# Altium project DTCP v1.2.PrjPcb (part 2 of 2)

## Sheet Boost 12V.SchDoc
size A4; SheetNumber: 3; SheetTotal: 12
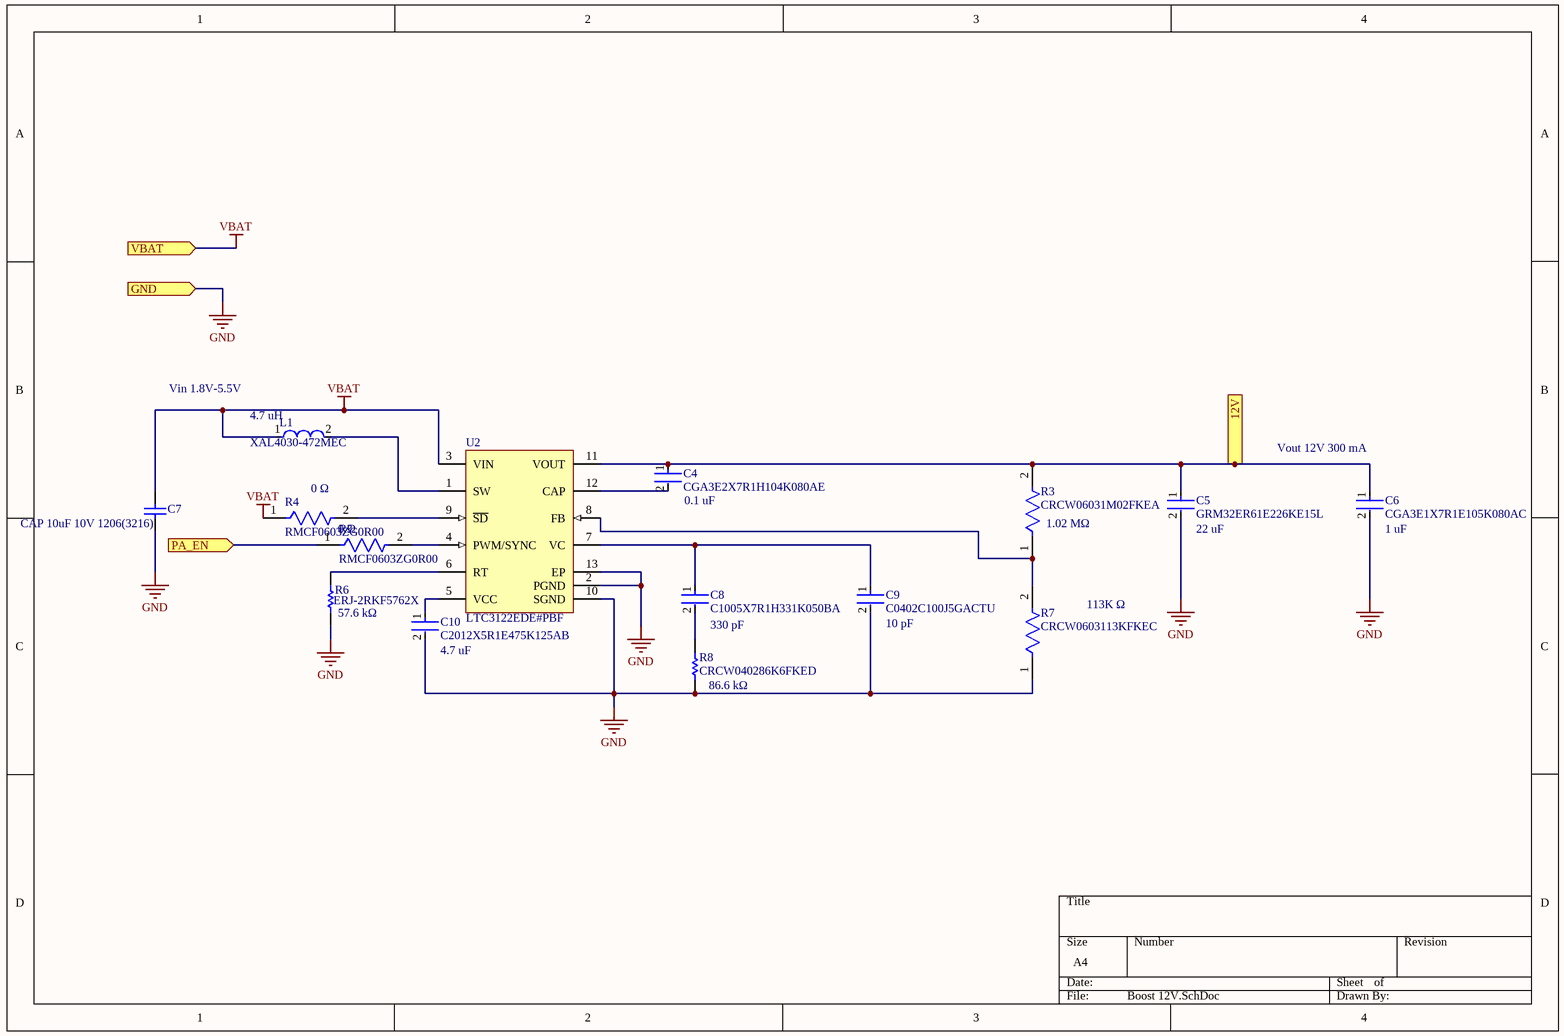
[diagram p7: Boost 12V.SchDoc]

### Parts
(Parts that share a designator on the sheet are numbered #1, #2 ... from top to bottom, then left to right.)
C4  CGA3E2X7R1H104K080AE  [FP-CGA3E-0_3-0_1-IPC_A]
C5  GRM32ER61E226KE15L  [FP-GRM32-MFG]
C6  CGA3E1X7R1E105K080AC  [FP-CGA3E-0_3-0_1-IPC_A]
C7  CAP 10uF 10V 1206(3216)  [CAPC1206(3216)190_L]
C8  C1005X7R1H331K050BA  [FP-C1005-050-0_05-IPC_B]
C9  C0402C100J5GACTU  [FP-C0402-BB-MFG]
C10  C2012X5R1E475K125AB  [FP-C2012-125-0_2-MFG]
L1  XAL4030-472MEC  [FP-XAL4030-472MEC-MFG]
R3  CRCW06031M02FKEA  [FP-CRCW0603-e3-IPC_A]
R4  RMCF0603ZG0R00  [FP-RMCF0603-IPC_B]
R6  ERJ-2RKF5762X  [RESC1005X40X25NL05T05]
R7  CRCW0603113KFKEC  [FP-CRCW0603-e3-MFG]
R8  CRCW040286K6FKED  [RESC1005X40X25NL05T05]
R?#2  RMCF0603ZG0R00  [FP-RMCF0603-IPC_B]
U2  LTC3122EDE#PBF  [LT-DE-UE-12_V]

### Ports
12V (out), GND (in), PA_EN (in), VBAT (in)

### Nets
12V0: C4.1 C5.1 C6.1 R3.2 U2.11(VOUT) ; port 12V
GND: C5.2 C6.2 C7.1 C9.2 C10.2 R6.1 R7.1 R8.1 U2.2(PGND) U2.10(SGND) U2.13(EP) ; port GND
VBAT: C7.2 L1.1 R4.1 U2.3(VIN) ; port VBAT
NetC4_2: C4.2 U2.12(CAP)
NetC8_1: C8.1 C9.1 U2.7(VC)
NetC8_2: C8.2 R8.2
NetC10_1: C10.1 U2.5(VCC)
NetL1_2: L1.2 U2.1(SW)
NetR3_1: R3.1 R7.2 U2.8(FB)
NetR4_2: R4.2 U2.9(~{SD})
NetR6_2: R6.2 U2.6(RT)
NetR?#2_1: R?#2.1 ; port PA_EN
NetR?#2_2: R?#2.2 U2.4(PWM/SYNC)

### Notes on the sheet
- Vin 1.8V-5.5V
- (near L1) 4.7 uH
- (near C6) Vout 12V 300 mA
- (near R4) 0 Ω
- (near C4) 0.1 uF
- 0 Ω
- (near R3) 1.02 MΩ
- (near C5) 22 uF
- (near C6) 1 uF
- (near R6) 57.6 kΩ
- (near C10) 4.7 uF
- 330 pF
- (near C9) 10 pF
- 113K Ω
- (near R8) 86.6 kΩ

### Library data of the parts
C4 = CMP-08246-002410-1: Cap Ceramic 100nF 50V X7R 10% Pad SMD 0603 +125°C Automotive T/R; Thickness: 0.035inch; Dielectric: X7R; Height: 0.8mm; Min Operating Temperature: -55°C; Package Quantity: 4000; Voltage Rating: 50V; Voltage Rating (DC): 50V; Lead Free: Lead Free; Case Code (Metric): 1608; Ratings: AEC-Q200; Capacitance: 100nF; Length: 0.063inch; Width: 0.8mm; Weight: 7.1E-05oz; Case/Package: 0603; Case Code (Imperial): 0603; Termination: SMD/SMT; Mount: Surface Mount; Packaging: Tape and Reel; Max Operating Temperature: 125°C; Tolerance: 10%; Features: Soft Termination
C5 = CMP-2000-05458-2: CAP CER 22UF 25V X5R 1210; Manufacturer: Murata Electronics North America; Possible Substitute: GRM32ER61E226KE15K; Other Names: 490-3889-2; Material: Ceramic; Tolerance: 10%; Digikey Description: CAP CER 22UF 25V X5R 1210; Mouser Description: Multilayer Ceramic Capacitors MLCC - SMD/SMT 1210 22uF 25volts X5R 10%; Device Class L2: Capacitors; Height: 2.7mm; Temperature Characteristic: X5R; Category: Cap; RoHS: TRUE; Operating Temperature: -55°C ~ 85°C; Temperature: -55°C to +85°C; Lead Free: Yes; Package: GRM32; Temperature Range High: +85°C; Package / Case: 1210 (3225 Metric); Standard Package: 1,000; Packaging: Cut Tape (CT); Capacitance: 22uF; Thickness (Max): 0.106" (2.70mm); Value: 22uF; Automotive: No; Device Class L1: Passive Components; Voltage - Rated: 25V; Temperature Range Low: -55°C; Size / Dimension: 0.126" L x 0.098" W (3.20mm x 2.50mm); ComponentLink2Description: Datasheet; Device Class L3: Ceramic Capacitors; Temperature Coefficient: X5R; ComponentLink2URL: https://search.murata.co.jp/Ceramy/image/img/A01X/G101/ENG/GRM32ER61E226KE15-01A.pdf; Voltage Rating: 25V; Manufacturer Part Number: GRM32ER61E226KE15L; Octopart: https://octopart.com/grm32er61e226ke15l-murata-197441; Applications: General Purpose; Mounting Type: Surface Mount, MLCC
C6 = CMP-08246-001507-1: Cap Ceramic 1uF 25V X7R 10% Pad SMD 0603 +125°C Automotive T/R; Dielectric: X7R; Capacitance: 1uF; Voltage Rating: 25V; Thickness: 0.035inch; Width: 0.031inch; Ratings: AEC-Q200; Case Code (Metric): 1608; REACH SVHC: No SVHC; Voltage: 25V; Composition: Ceramic; Min Operating Temperature: -55°C; Termination: SMD/SMT; Depth: 0.8mm; Max Operating Temperature: 125°C; Mount: Surface Mount; Weight: 7.1E-05oz; Package Quantity: 4000; Tolerance: 10%; Packaging: Tape and Reel; Lead Free: Lead Free; Case/Package: 0603; Length: 1.6mm; Height: 0.8mm; Case Code (Imperial): 0603; Voltage Rating (DC): 25V
C7 = CMP-1037-04967-1: CAP 10uF 10V ±10% 1206 (3216 Metric) Thickness 1.9mm SMD; Tolerance: Â±10%; Case-Metric: 3216; Case-EIA: 1206; Rated Voltage: 10 V; Max Thickness: 1.9 mm; Technology: SMT; Value: 10uF
C8 = CMP-08246-002681-1: Multilayer Ceramic Capacitors 330pF ±10% 50V X7R SMD 0402; Height: 0.5mm; Min Operating Temperature: -55°C; Construction: Flat; Voltage Rating (DC): 50V; Depth: 0.5mm; Number of Pins: 2; Capacitance: 330pF; Case/Package: 0402; REACH SVHC: No SVHC; Lead Free: Lead Free; Thickness: 0.022inch; Package Quantity: 1; Case Code (Imperial): 0402; Max Operating Temperature: 125°C; RoHS Compliant: Yes; Voltage Rating: 50V; Length: 1mm; Weight: 2.3E-05oz; Width: 0.02inch; Case Code (Metric): 1005; Dielectric Material: Ceramic; Tolerance: 10%; Mount: Surface Mount; Dielectric: X7R; Series: C; Resistor Type: Ceramic; Termination: SMD/SMT; Packaging: Tape and Reel
C9 = CMP-2008-03404-2: Multilayer Ceramic Capacitor, C Series, 10 Pf, - 5%, C0G / Np0, 50 V, 0402 [1005 Metric] Rohs Compliant: Yes; Manufacturer: Kemet; Temperature Coefficient: 15%; Voltage Rating: 50 V; Capacitance: 10 pF; Value: 10 pF; Tolerance: 0.05; Automotive: No; Temperature Range High: +125°C; ComponentLink2Description: Datasheet; Manufacturer Part Number: C0402C100J5GACTU; Material: Ceramic; Lead Free: Yes; ComponentLink2URL: https://content.kemet.com/datasheets/KEM_C1002_X7R_SMD.pdf; Device Class L3: Ceramic Capacitors; RoHS: TRUE; Package: C0402-BB; Temperature: -55°C to +125°C; Temperature Range Low: -55°C; Height: 0.55mm; Mouser Description: Multilayer Ceramic Capacitor, C Series, 10 Pf, - 5%, C0G / Np0, 50 V, 0402 [1005 Metric] Rohs Compliant: Yes; Octopart: https://octopart.com/c0402c100j5gactu-kemet-108448; Digikey Description: Multilayer Ceramic Capacitor, C Series, 10 Pf, - 5%, C0G / Np0, 50 V, 0402 [1005 Metric] Rohs Compliant: Yes; Temperature Characteristic: C0G; Category: Cap; Ipc Land Pattern Name: CAPC10050X50; Device Class L1: Passive Components; Device Class L2: Capacitors
C10 = CMP-08246-004908-1: Multilayer Ceramic Capacitors 4.7μF ±10% 25V X5R SMD 0805; Capacitance: 4.7uF; Lead Free: Lead Free; Thickness: 0.057inch; Packaging: Tape and Reel; Min Operating Temperature: -55°C; RoHS Compliant: Yes; Dielectric: X5R; Weight: 0.000194oz; REACH SVHC: No SVHC; Voltage Rating (DC): 25V; Mount: Surface Mount; Resistor Type: Ceramic; Termination: SMD/SMT; Number of Pins: 2; Case Code (Imperial): 0805; Dielectric Material: Ceramic; Voltage: 25V; Voltage Rating: 25V; Case Code (Metric): 2012; Case/Package: 0805; Max Operating Temperature: 85°C; Height: 1.25mm; Tolerance: 10%; Depth: 1.25mm; Package Quantity: 1; Length: 2mm; Radiation Hardening: No; Width: 1.25mm
L1 = CMP-11268-000082-1: Power Inductor (SMD), 4.7 µH, 5.1 A, Shielded, 4.5 A, XAL40xx Series, 4mm x 4mm x 3.1mm; Tolerance: 20%; DC Resistance (DCR): 44.1mR; Inductance: 4.7uH; Saturation Current: 4.5A; Max DC Current: 5.1A; Self Resonant Frequency: 36MHz; Test Frequency: 100kHz; Core Material: Composite; REACH SVHC: No SVHC; Height: 3.1mm; Package Quantity: 500; Width: 4.3mm; Mount: Surface Mount; RoHS Compliant: Yes; Case/Package: SMD/SMT; Length: 4.3mm; Packaging: Tape and Reel; Max Operating Temperature: 125°C; Min Operating Temperature: -40°C; Series: XAL4030; Termination: SMD/SMT; Inductance Tolerance: 20%; Shielding: Shielded; RMS Current (Irms): 5.1A; Lead Free: Contains Lead
R3 = CMP-2000-03018-2: RES Thick Film, 1.02MΩ, 1%, 0.1W, 100ppm/°C, 0603; Voltage Rating (DC): 75V; Power Rating: 100mW; Resistance: 1.02MR; Features: Automotive AEC-Q200; Depth: 0.85mm; Max Operating Temperature: 155°C; Tolerance: 1%; Package Quantity: 10; Length: 1.55mm; Mount: Surface Mount; Termination: SMD/SMT; Width: 0.033inch; Temperature Coefficient: 100ppm/°C; Min Operating Temperature: -55°C; Composition: Thick Film; Max Power Dissipation: 100mW; Case Code (Imperial): 0603; Case/Package: 0603; Voltage Rating: 75V; Contact Plating: Tin; Case Code (Metric): 1608; Weight: 7.1E-05oz; Lead Free: Lead Free; Height: 0.02inch; Military Standard: Not; Number of Terminations: 2; Radiation Hardening: No; Packaging: Tape and Reel
R4 R?#2 = CMP-26527-006412-1: 0Ω ±0 0.1W 0603 Thick Film Chip Resistor AEC-Q200 compliant; Max Power Dissipation: 100mW; Resistance: 0R; Width: 0.031inch; RoHS Compliant: Yes; Number of Terminations: 2; Case/Package: 0603; Contact Plating: Tin; Height: 0.022inch; Resistor Type: Thick Film; Mount: Surface Mount; Length: 0.061inch; Features: Automotive AEC-Q200; Series: RMCF; Max Operating Temperature: 155°C; Radiation Hardening: No; Min Operating Temperature: -55°C; Packaging: Tape and Reel
R6 = CMP-2002-01001-1: Manufacturer: Panasonic; Part Number: ERJ-2RKF5762X
R7 = CMP-02407-003381-1: RES Thick Film, 113kΩ, 1%, 0.1W, 100ppm/°C, 0603; Power Rating: 100mW; Resistance: 113kR; Packaging: Tape and Reel; Width: 0.033inch; Lead Free: Lead Free; Case/Package: 0603; Height: 0.02inch; Length: 0.061inch; Max Power Dissipation: 100mW; Composition: Thick Film; Tolerance: 1%; Number of Terminations: 2; Max Operating Temperature: 155°C; Min Operating Temperature: -55°C; Temperature Coefficient: 100ppm/°C; Features: Automotive AEC-Q200; Package Quantity: 20000
R8 = CMP-2002-00247-1: Manufacturer: Vishay Dale; Part Number: CRCW040286K6FKED
U2 = CMP-0492-00369-1: 2.5 A Synchronous Step-Up DC/DC Converter with Output Disconnect, 12-pin SON (DE-UE-12), -40 to 125 degC, Pb-Free; Manufacturer: Linear Technology; Number of Outputs: 1; ComponentLink2URL: http://cds.linear.com/docs/en/datasheet/3122fa.pdf; ComponentLink1URL: http://www.linear.com/; Code_JEDEC: MO-229; ComponentLink2Description: Datasheet; ComponentLink1Description: Manufacturer URL; PackageReference: DE-UE-12; PackageVersion: Rev. D, 06/2010; ComponentLink3Description: Package Specification; PackageDescription: 12-Pin Plastic DFN, Body 4 x 3 mm, Pitch 0.5 mm; PartNumber: LTC3122EDE#PBF; ComponentLink3URL: http://cds.linear.com/docs/en/packaging/DFN_12_05-08-1695.pdf; Mounting Technology: Surface Mount; RoHS: TRUE; DatasheetVersion: Rev. A

## Sheet Switch1.SchDoc
size A; SheetNumber: 4; SheetTotal: 12
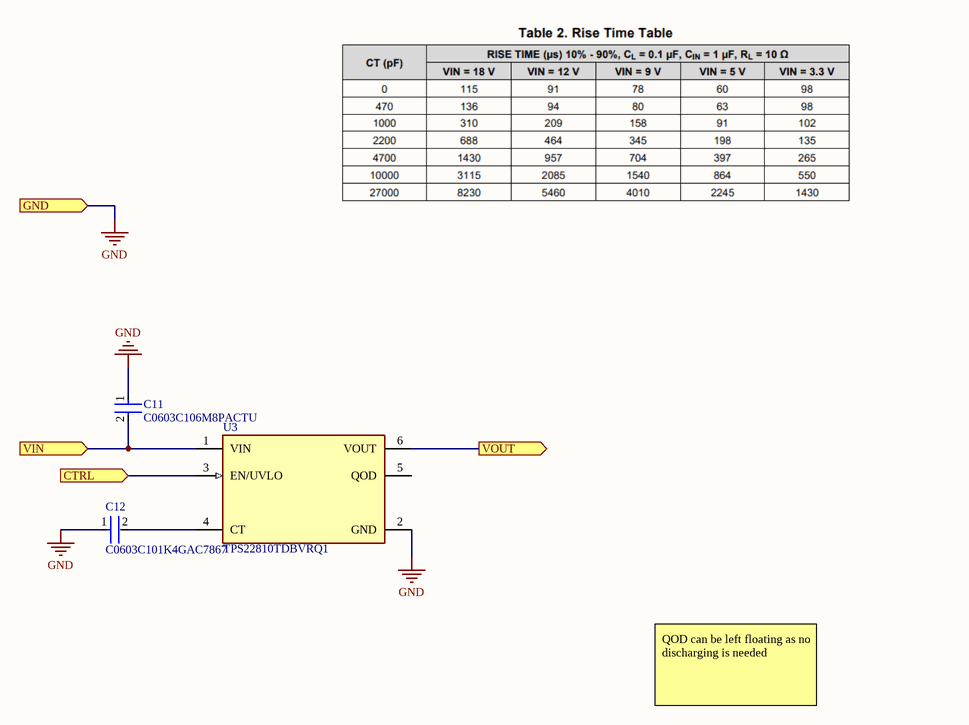
[diagram p8: Switch1.SchDoc]

### Parts
C11  C0603C106M8PACTU  [FP-C0603C106M8PACTU-MFG]
C12  C0603C101K4GAC7867  [FP-C0603C-CF-MFG]
U3  TPS22810TDBVRQ1  [FP-DBV0006A-MFG]

### Ports
CTRL (in), GND (in), VIN (in), VOUT (out)

### Nets
3V3: C11.2 U3.1(VIN) ; port VIN
3V3DDS: U3.6(VOUT) ; port VOUT
GND: C11.1 C12.1 U3.2(GND) ; port GND
NetC12_2: C12.2 U3.4(CT)
NetR1_2: U3.3(EN/UVLO) ; port CTRL

Not connected (* = marked no-connect by the designer): U3 5(QOD)

### Notes on the sheet
- QOD can be left floating as no discharging is needed

### Library data of the parts
C11 = CMP-03020-034654-1: CAP CER 10UF 10V X5R 0603; RoHS Compliant: Yes
C12 = CMP-03020-014723-2: CAP CER 100PF 16V NP0 0603; Manufacturer: KEMET; Automotive Grade: Grade 1; Material: Ceramic; Temperature Characteristic: C0G; Temperature Coefficient: 30ppm/°C; Tolerance: 0.1; Category: Cap; Temperature Range High: +125°C; RoHS: TRUE; Device Class L2: Capacitors; Automotive: Yes; Height: 0.87mm; Value: 100 pF; ComponentLink2Description: Datasheet; Digikey Description: CAP CER 100PF 16V NP0 0603; Manufacturer Part Number: C0603C101K4GAC7867; ComponentLink2URL: https://api.kemet.com/component-edge/download/datasheet/C0603C100J5GACAUTO.pdf; Device Class L1: Passive Components; Device Class L3: Ceramic Capacitors; Temperature: -55°C to +125°C; Lead Free: Yes; Capacitance: 100 pF; Temperature Range Low: -55°C; Voltage Rating: 16 V; Package: C0603C-CF; Octopart: https://octopart.com/c0603c101k4gac7867-kemet-1494535
U3 = CMP-04910-000007-2: IC PWR SWITCH N-CHAN 1:1 SOT23-6; Max Output Current: 2A; Max Supply Voltage: 18V; Min Supply Voltage: 2.7V; Number of Outputs: 1; Output Configuration: High Side; Fault Protection: Over Temperature; Interface: On/Off; Weight: 0.000801oz; Case/Package: SOT-23-6; Series: TPS22810-Q1; Package Quantity: 3000; RoHS Compliant: Yes; Number of Channels: 1; Max Operating Temperature: 105°C; Packaging: Cut Tape; Min Operating Temperature: -40°C

## Sheet Switch2.SchDoc
size A; SheetNumber: 11; SheetTotal: 12
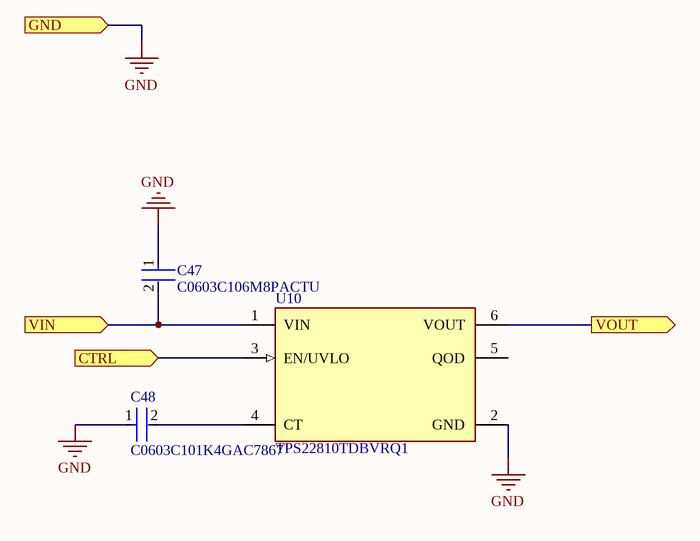
[diagram p9: Switch2.SchDoc]

### Parts
C47  C0603C106M8PACTU  [FP-C0603C106M8PACTU-MFG]
C48  C0603C101K4GAC7867  [FP-C0603C-CF-MFG]
U10  TPS22810TDBVRQ1  [FP-DBV0006A-MFG]

### Ports
CTRL (in), GND (in), VIN (in), VOUT (out)

### Nets
GND: C47.1 C48.1 U10.2(GND) ; port GND
PA2_VDD: U10.6(VOUT) ; port VOUT
NetC47_2: C47.2 U10.1(VIN) ; port VIN
NetC48_2: C48.2 U10.4(CT)
NetR?#2_1: U10.3(EN/UVLO) ; port CTRL

Not connected (* = marked no-connect by the designer): U10 5(QOD)

### Library data of the parts
C47 = CMP-03020-034654-1: CAP CER 10UF 10V X5R 0603; RoHS Compliant: Yes
C48 = CMP-03020-014723-2: as C12 on sheet Switch1; Category: Cap; Temperature Range High: +125°C; RoHS: TRUE; Device Class L2: Capacitors; Automotive: Yes; Height: 0.87mm; Value: 100 pF; ComponentLink2Description: Datasheet; Digikey Description: CAP CER 100PF 16V NP0 0603; Manufacturer Part Number: C0603C101K4GAC7867; ComponentLink2URL: https://api.kemet.com/component-edge/download/datasheet/C0603C100J5GACAUTO.pdf; Device Class L1: Passive Components; Device Class L3: Ceramic Capacitors; Temperature: -55°C to +125°C; Lead Free: Yes; Capacitance: 100 pF; Temperature Range Low: -55°C; Voltage Rating: 16 V; Package: C0603C-CF; Octopart: https://octopart.com/c0603c101k4gac7867-kemet-1494535
U10 = CMP-04910-000007-2: as U3 on sheet Switch1; Weight: 0.000801oz; Case/Package: SOT-23-6; Series: TPS22810-Q1; Package Quantity: 3000; RoHS Compliant: Yes; Number of Channels: 1; Max Operating Temperature: 105°C; Packaging: Cut Tape; Min Operating Temperature: -40°C

## Sheet Boost 5V.SchDoc
size A; SheetNumber: 12; SheetTotal: 12
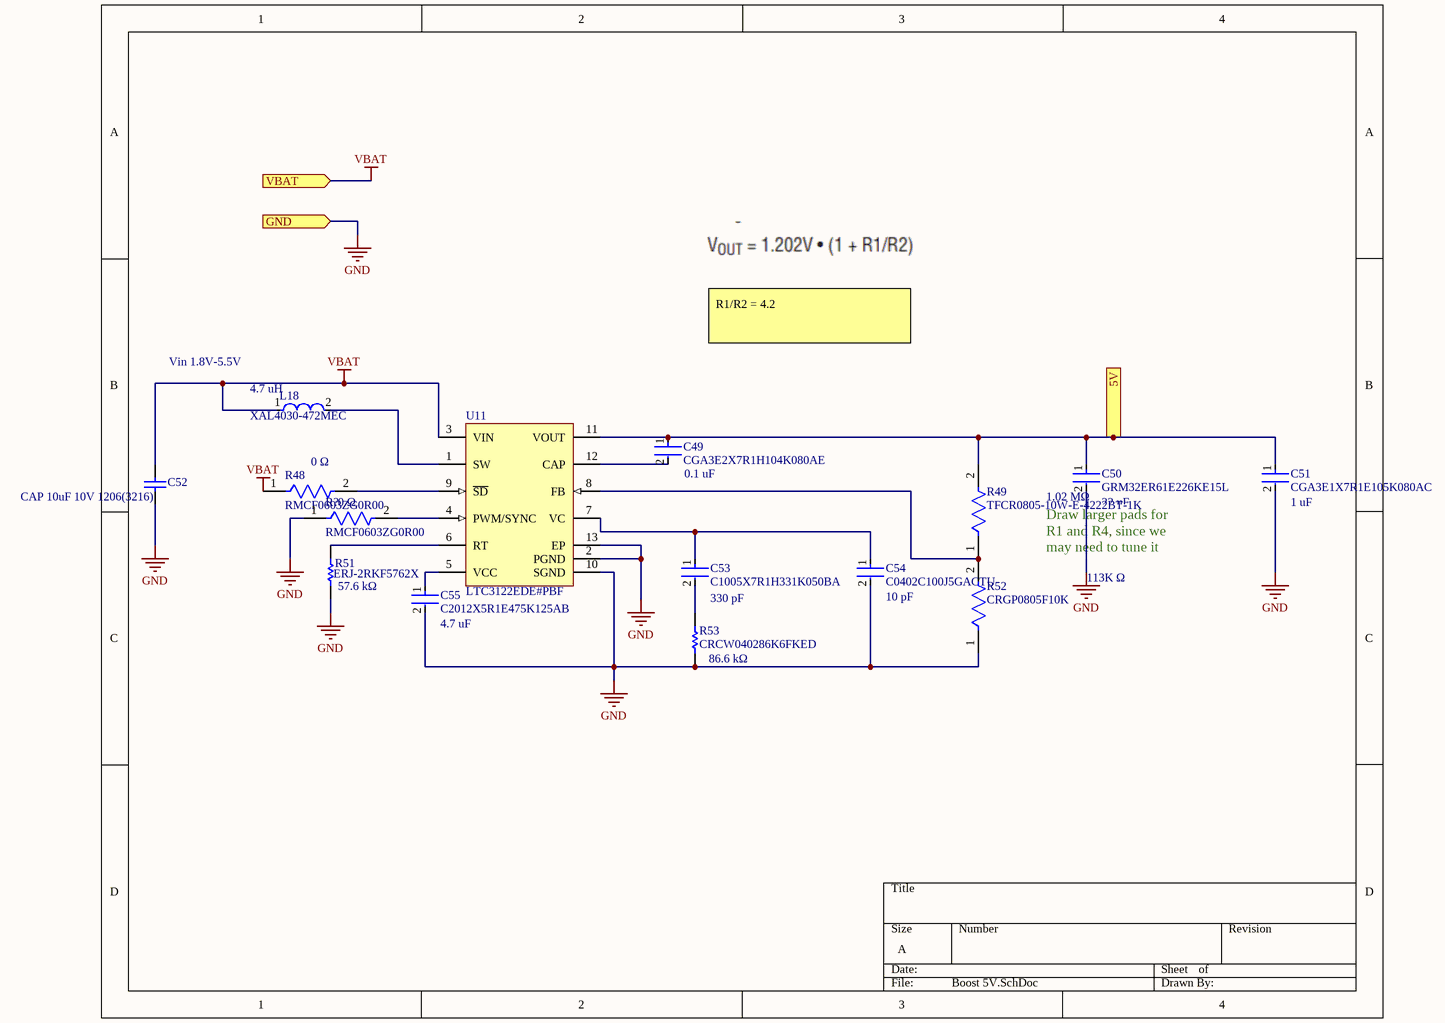
[diagram p10: Boost 5V.SchDoc]

### Parts
(Parts that share a designator on the sheet are numbered #1, #2 ... from top to bottom, then left to right.)
C49  CGA3E2X7R1H104K080AE  [FP-CGA3E-0_3-0_1-IPC_A]
C50  GRM32ER61E226KE15L  [FP-GRM32-MFG]
C51  CGA3E1X7R1E105K080AC  [FP-CGA3E-0_3-0_1-IPC_A]
C52  CAP 10uF 10V 1206(3216)  [CAPC1206(3216)190_L]
C53  C1005X7R1H331K050BA  [FP-C1005-050-0_05-IPC_B]
C54  C0402C100J5GACTU  [FP-C0402-BB-MFG]
C55  C2012X5R1E475K125AB  [FP-C2012-125-0_2-MFG]
L18  XAL4030-472MEC  [FP-XAL4030-472MEC-MFG]
R48  RMCF0603ZG0R00  [FP-RMCF0603-IPC_B]
R49  TFCR0805-10W-E-4222BT-1K  [FP-TFCR0805-IPC_A]
R51  ERJ-2RKF5762X  [RESC1005X40X25NL05T05]
R52  CRGP0805F10K  [FP-CRGP0805-IPC_C]
R53  CRCW040286K6FKED  [RESC1005X40X25NL05T05]
R?#3  RMCF0603ZG0R00  [FP-RMCF0603-IPC_B]
U11  LTC3122EDE#PBF  [LT-DE-UE-12_V]

### Ports
5V (out), GND (in), VBAT (in)

### Nets
5V0: C49.1 C50.1 C51.1 R49.2 U11.11(VOUT) ; port 5V
GND: C50.2 C51.2 C52.1 C54.2 C55.2 R51.1 R52.1 R53.1 R?#3.1 U11.2(PGND) U11.10(SGND) U11.13(EP) ; port GND
VBAT: C52.2 L18.1 R48.1 U11.3(VIN) ; port VBAT
NetC49_2: C49.2 U11.12(CAP)
NetC53_1: C53.1 C54.1 U11.7(VC)
NetC53_2: C53.2 R53.2
NetC55_1: C55.1 U11.5(VCC)
NetL18_2: L18.2 U11.1(SW)
NetR48_2: R48.2 U11.9(~{SD})
NetR49_1: R49.1 R52.2 U11.8(FB)
NetR51_2: R51.2 U11.6(RT)
NetR?#3_2: R?#3.2 U11.4(PWM/SYNC)

### Notes on the sheet
- Vin 1.8V-5.5V
- R1/R2 = 4.2
- (near L18) 4.7 uH
- (near R48) 0 Ω
- 0 Ω
- (near C49) 0.1 uF
- (near C50) 1.02 MΩ
- (near C50) 22 uF
- (near C51) 1 uF
- (near C50) Draw larger pads for R1 and R4, since we may need to tune it
- (near R51) 57.6 kΩ
- (near C55) 4.7 uF
- 330 pF
- (near C54) 10 pF
- 113K Ω
- (near R53) 86.6 kΩ

### Library data of the parts
C49 = CMP-08246-002410-1: as C4 on sheet Boost 12V; Thickness: 0.035inch; Dielectric: X7R; Height: 0.8mm; Min Operating Temperature: -55°C; Package Quantity: 4000; Voltage Rating: 50V; Voltage Rating (DC): 50V; Lead Free: Lead Free; Case Code (Metric): 1608; Ratings: AEC-Q200; Capacitance: 100nF; Length: 0.063inch; Width: 0.8mm; Weight: 7.1E-05oz; Case/Package: 0603; Case Code (Imperial): 0603; Termination: SMD/SMT; Mount: Surface Mount; Packaging: Tape and Reel; Max Operating Temperature: 125°C; Tolerance: 10%; Features: Soft Termination
C50 = CMP-2000-05458-2: as C5 on sheet Boost 12V; Digikey Description: CAP CER 22UF 25V X5R 1210; Mouser Description: Multilayer Ceramic Capacitors MLCC - SMD/SMT 1210 22uF 25volts X5R 10%; Device Class L2: Capacitors; Height: 2.7mm; Temperature Characteristic: X5R; Category: Cap; RoHS: TRUE; Operating Temperature: -55°C ~ 85°C; Temperature: -55°C to +85°C; Lead Free: Yes; Package: GRM32; Temperature Range High: +85°C; Package / Case: 1210 (3225 Metric); Standard Package: 1,000; Packaging: Cut Tape (CT); Capacitance: 22uF; Thickness (Max): 0.106" (2.70mm); Value: 22uF; Automotive: No; Device Class L1: Passive Components; Voltage - Rated: 25V; Temperature Range Low: -55°C; Size / Dimension: 0.126" L x 0.098" W (3.20mm x 2.50mm); ComponentLink2Description: Datasheet; Device Class L3: Ceramic Capacitors; Temperature Coefficient: X5R; ComponentLink2URL: https://search.murata.co.jp/Ceramy/image/img/A01X/G101/ENG/GRM32ER61E226KE15-01A.pdf; Voltage Rating: 25V; Manufacturer Part Number: GRM32ER61E226KE15L; Octopart: https://octopart.com/grm32er61e226ke15l-murata-197441; Applications: General Purpose; Mounting Type: Surface Mount, MLCC
C51 = CMP-08246-001507-1: as C6 on sheet Boost 12V; Dielectric: X7R; Capacitance: 1uF; Voltage Rating: 25V; Thickness: 0.035inch; Width: 0.031inch; Ratings: AEC-Q200; Case Code (Metric): 1608; REACH SVHC: No SVHC; Voltage: 25V; Composition: Ceramic; Min Operating Temperature: -55°C; Termination: SMD/SMT; Depth: 0.8mm; Max Operating Temperature: 125°C; Mount: Surface Mount; Weight: 7.1E-05oz; Package Quantity: 4000; Tolerance: 10%; Packaging: Tape and Reel; Lead Free: Lead Free; Case/Package: 0603; Length: 1.6mm; Height: 0.8mm; Case Code (Imperial): 0603; Voltage Rating (DC): 25V
C52 = CMP-1037-04967-1: as C7 on sheet Boost 12V; Rated Voltage: 10 V; Max Thickness: 1.9 mm; Technology: SMT; Value: 10uF
C53 = CMP-08246-002681-1: as C8 on sheet Boost 12V; Height: 0.5mm; Min Operating Temperature: -55°C; Construction: Flat; Voltage Rating (DC): 50V; Depth: 0.5mm; Number of Pins: 2; Capacitance: 330pF; Case/Package: 0402; REACH SVHC: No SVHC; Lead Free: Lead Free; Thickness: 0.022inch; Package Quantity: 1; Case Code (Imperial): 0402; Max Operating Temperature: 125°C; RoHS Compliant: Yes; Voltage Rating: 50V; Length: 1mm; Weight: 2.3E-05oz; Width: 0.02inch; Case Code (Metric): 1005; Dielectric Material: Ceramic; Tolerance: 10%; Mount: Surface Mount; Dielectric: X7R; Series: C; Resistor Type: Ceramic; Termination: SMD/SMT; Packaging: Tape and Reel
C54 = CMP-2008-03404-2: as C9 on sheet Boost 12V; Automotive: No; Temperature Range High: +125°C; ComponentLink2Description: Datasheet; Manufacturer Part Number: C0402C100J5GACTU; Material: Ceramic; Lead Free: Yes; ComponentLink2URL: https://content.kemet.com/datasheets/KEM_C1002_X7R_SMD.pdf; Device Class L3: Ceramic Capacitors; RoHS: TRUE; Package: C0402-BB; Temperature: -55°C to +125°C; Temperature Range Low: -55°C; Height: 0.55mm; Mouser Description: Multilayer Ceramic Capacitor, C Series, 10 Pf, - 5%, C0G / Np0, 50 V, 0402 [1005 Metric] Rohs Compliant: Yes; Octopart: https://octopart.com/c0402c100j5gactu-kemet-108448; Digikey Description: Multilayer Ceramic Capacitor, C Series, 10 Pf, - 5%, C0G / Np0, 50 V, 0402 [1005 Metric] Rohs Compliant: Yes; Temperature Characteristic: C0G; Category: Cap; Ipc Land Pattern Name: CAPC10050X50; Device Class L1: Passive Components; Device Class L2: Capacitors
C55 = CMP-08246-004908-1: as C10 on sheet Boost 12V; Lead Free: Lead Free; Thickness: 0.057inch; Packaging: Tape and Reel; Min Operating Temperature: -55°C; RoHS Compliant: Yes; Dielectric: X5R; Weight: 0.000194oz; REACH SVHC: No SVHC; Voltage Rating (DC): 25V; Mount: Surface Mount; Resistor Type: Ceramic; Termination: SMD/SMT; Number of Pins: 2; Case Code (Imperial): 0805; Dielectric Material: Ceramic; Voltage: 25V; Voltage Rating: 25V; Case Code (Metric): 2012; Case/Package: 0805; Max Operating Temperature: 85°C; Height: 1.25mm; Tolerance: 10%; Depth: 1.25mm; Package Quantity: 1; Length: 2mm; Radiation Hardening: No; Width: 1.25mm
L18 = CMP-11268-000082-1: as L1 on sheet Boost 12V; REACH SVHC: No SVHC; Height: 3.1mm; Package Quantity: 500; Width: 4.3mm; Mount: Surface Mount; RoHS Compliant: Yes; Case/Package: SMD/SMT; Length: 4.3mm; Packaging: Tape and Reel; Max Operating Temperature: 125°C; Min Operating Temperature: -40°C; Series: XAL4030; Termination: SMD/SMT; Inductance Tolerance: 20%; Shielding: Shielded; RMS Current (Irms): 5.1A; Lead Free: Contains Lead
R48 R?#3 = CMP-26527-006412-1: as R4 on sheet Boost 12V; Width: 0.031inch; RoHS Compliant: Yes; Number of Terminations: 2; Case/Package: 0603; Contact Plating: Tin; Height: 0.022inch; Resistor Type: Thick Film; Mount: Surface Mount; Length: 0.061inch; Features: Automotive AEC-Q200; Series: RMCF; Max Operating Temperature: 155°C; Radiation Hardening: No; Min Operating Temperature: -55°C; Packaging: Tape and Reel
R49 = CMP-250906-237835-1: RES Thin Film,  42.2kΩ, 0.1%, 0.1W, 25ppm/°C, 0805
R51 = CMP-2002-01001-1: Manufacturer: Panasonic; Part Number: ERJ-2RKF5762X
R52 = CMP-03211-006861-1: CRGP 0805 10K 1%; Manufacturer: TE; Power Rating: 0.33W; Voltage Rating: 150V; Value: 10KΩ; Tolerance: 0.01; Temperature Coefficient: ±100ppm/°C; Manufacturer Part Number: CRGP0805F10K; ComponentLink2URL: https://www.mouser.com/datasheet/2/418/NG_DS_9-1773463-9_A-1358566.pdf; Temperature Range Low: -55°C; Ipc Land Pattern Name: RESC200125X55; Device Class L2: Resistors; Automotive: No; Device Class L3: Chip SMD Resistors; Composition: Thick Film; Temperature Range High: +155°C; Temperature: -55°C to +155°C; Height: 0.65mm; Series: CRGP; RoHS: TRUE; Device Class L1: Passive Components; Octopart: https://octopart.com/crgp0805f10k-te+connectivity-91018782; Package: CRGP0805; Digikey Description: CRGP 0805 10K 1%; Ambient Temperature Range High: +70°C; Lead Free: Yes; ComponentLink2Description: Datasheet; Category: Res; Resistance: 10KΩ
R53 = CMP-2002-00247-1: Manufacturer: Vishay Dale; Part Number: CRCW040286K6FKED
U11 = CMP-0492-00369-1: as U2 on sheet Boost 12V; ComponentLink2URL: http://cds.linear.com/docs/en/datasheet/3122fa.pdf; ComponentLink1URL: http://www.linear.com/; Code_JEDEC: MO-229; ComponentLink2Description: Datasheet; ComponentLink1Description: Manufacturer URL; PackageReference: DE-UE-12; PackageVersion: Rev. D, 06/2010; ComponentLink3Description: Package Specification; PackageDescription: 12-Pin Plastic DFN, Body 4 x 3 mm, Pitch 0.5 mm; PartNumber: LTC3122EDE#PBF; ComponentLink3URL: http://cds.linear.com/docs/en/packaging/DFN_12_05-08-1695.pdf; Mounting Technology: Surface Mount; RoHS: TRUE; DatasheetVersion: Rev. A

## Sheet AFE.SchDoc
size A; SheetNumber: 7; SheetTotal: 12
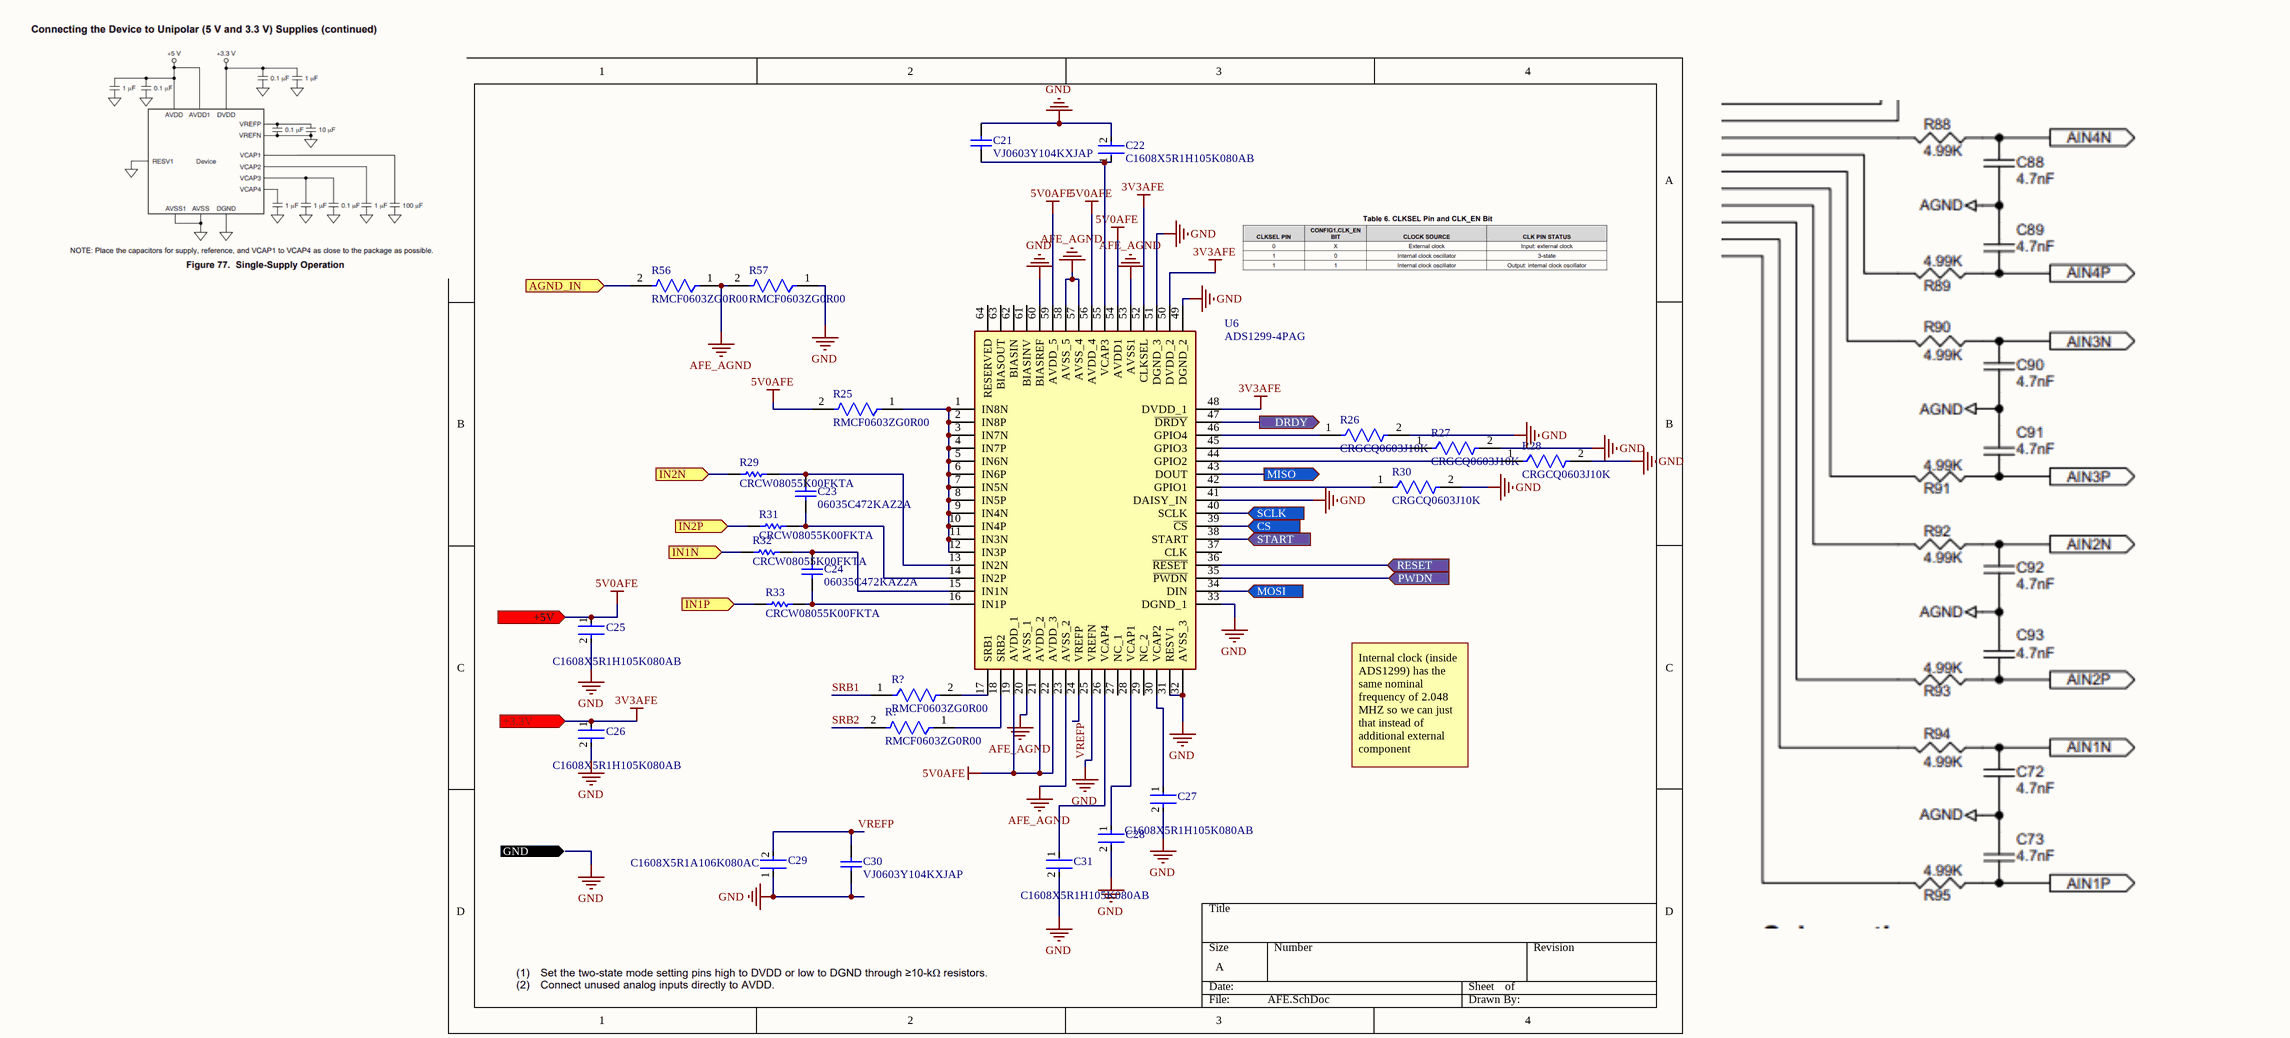
[diagram p11: AFE.SchDoc]

### Parts
(Parts that share a designator on the sheet are numbered #1, #2 ... from top to bottom, then left to right.)
C21  VJ0603Y104KXJAP  [CAPC1608X92X38NL15T08]
C22  C1608X5R1H105K080AB  [FP-C1608-080-0_1-IPC_B]
C23  06035C472KAZ2A  [CAPC1608X90X35LL15T15]
C24  06035C472KAZ2A  [CAPC1608X90X35LL15T15]
C25  C1608X5R1H105K080AB  [FP-C1608-080-0_1-IPC_B]
C26  C1608X5R1H105K080AB  [FP-C1608-080-0_1-IPC_B]
C27  C1608X5R1H105K080AB  [FP-C1608-080-0_1-IPC_B]
C28  GRM21BR60J107ME15K  [FP-GRM21B-0_2-e0_2_0_7-IPC_B]  (value not drawn)
C29  C1608X5R1A106K080AC  [FP-C1608-080-0_1-MFG]
C30  VJ0603Y104KXJAP  [CAPC1608X92X38NL15T08]
C31  C1608X5R1H105K080AB  [FP-C1608-080-0_1-IPC_B]
R25  RMCF0603ZG0R00  [FP-RMCF0603-IPC_B]
R26  CRGCQ0603J10K  [FP-CRGCQ0603-IPC_C]
R27  CRGCQ0603J10K  [FP-CRGCQ0603-IPC_C]
R28  CRGCQ0603J10K  [FP-CRGCQ0603-IPC_C]
R29  CRCW08055K00FKTA  [RESC2013X50X30ML20T20]
R30  CRGCQ0603J10K  [FP-CRGCQ0603-IPC_C]
R31  CRCW08055K00FKTA  [RESC2013X50X30ML20T20]
R32  CRCW08055K00FKTA  [RESC2013X50X30ML20T20]
R33  CRCW08055K00FKTA  [RESC2013X50X30ML20T20]
R56  RMCF0603ZG0R00  [FP-RMCF0603-IPC_B]
R57  RMCF0603ZG0R00  [FP-RMCF0603-IPC_B]
R?#4  RMCF0603ZG0R00  [FP-RMCF0603-IPC_B]
R?#5  RMCF0603ZG0R00  [FP-RMCF0603-IPC_B]
U6  ADS1299-4PAG  [QFP50P1200X1200X120-64N]

### Ports
+3.3V (in), +5V (in), AGND_IN (in), CS (in), DRDY (out), GND (in), IN1N (in), IN1P (in), IN2N (in), IN2P (in), MISO (out), MOSI (in), PWDN (in), RESET (in), SCLK (in), START (in)

### Nets
3V3AFE: C26.1 U6.48(DVDD_1) U6.50(DVDD_2) U6.52(CLKSEL) ; port +3.3V  [project net 3V3]
5V0AFE: C25.1 R25.2 U6.19(AVDD_1) U6.21(AVDD_2) U6.22(AVDD_3) U6.54(AVDD1) U6.56(AVDD_4) U6.59(AVDD_5) ; port +5V  [project net 5V0]
AFE_AGND: R56.1 R57.2 U6.20(AVSS_1) U6.23(AVSS_2) U6.53(AVSS1) U6.57(AVSS_4) U6.58(AVSS_5)
GND: C21.2 C22.2 C25.2 C26.2 C27.2 C28.2 C29.1 C30.1 C31.2 R26.2 R27.2 R28.2 R30.2 R57.1 U6.25(VREFN) U6.31(RESV1) U6.32(AVSS_3) U6.33(DGND_1) U6.41(DAISY_IN) U6.49(DGND_2) U6.51(DGND_3) U6.60(BIASREF) ; port GND
AFE_RST: U6.36(~{RESET}) ; port RESET
CS: U6.39(~{CS}) ; port CS
DRDY: U6.47(~{DRDY}) ; port DRDY
MISO: U6.43(DOUT) ; port MISO
MOSI: U6.34(DIN) ; port MOSI
PWDN: U6.35(~{PWDN}) ; port PWDN
SCK: U6.40(SCLK) ; port SCLK
SRB1: R?#4.1
SRB2: R?#5.2
START: U6.38(START) ; port START
VREFP: C29.2 C30.2 U6.24(VREFP)
NetC21_1: C21.1 C22.1 U6.55(VCAP3)
NetC23_1: C23.1 R29.2 U6.13(IN2N)
NetC23_2: C23.2 R31.2 U6.14(IN2P)
NetC24_1: C24.1 R32.2 U6.15(IN1N)
NetC24_2: C24.2 R33.2 U6.16(IN1P)
NetC27_1: C27.1 U6.30(VCAP2)
NetC28_1: C28.1 U6.28(VCAP1)
NetC31_1: C31.1 U6.26(VCAP4)
NetP1_1: R33.1 ; port IN1P
NetP1_2: R32.1 ; port IN1N
NetP2_1: R31.1 ; port IN2P
NetP2_2: R29.1 ; port IN2N
NetP3_1: R56.2 ; port AGND_IN
NetR25_1: R25.1 U6.1(IN8N) U6.2(IN8P) U6.3(IN7N) U6.4(IN7P) U6.5(IN6N) U6.6(IN6P) U6.7(IN5N) U6.8(IN5P) U6.9(IN4N) U6.10(IN4P) U6.11(IN3N) U6.12(IN3P)
NetR26_1: R26.1 U6.46(GPIO4)
NetR27_1: R27.1 U6.45(GPIO3)
NetR28_1: R28.1 U6.44(GPIO2)
NetR30_1: R30.1 U6.42(GPIO1)
NetR?#4_2: R?#4.2 U6.17(SRB1)
NetR?#5_1: R?#5.1 U6.18(SRB2)

Not connected (* = marked no-connect by the designer): U6 27(NC_1) 29(NC_2) 37(CLK) 61(BIASINV) 62(BIASIN) 63(BIASOUT) 64(RESERVED)

### Notes on the sheet
- Internal clock (inside ADS1299) has the same nominal frequency of 2.048 MHZ so we can just that instead of additional external component

### Library data of the parts
C21 C30 = CMP-2006-01211-1: Manufacturer: Vitramon; Part Number: VJ0603Y104KXJAP
C22 C25-C27 C31 = CMP-2000-06025-2: Multilayer Ceramic Capacitors 1μF ±10% 50V X5R SMD 0603; Capacitance: 1uF; Lead Free: Lead Free; Height: 0.8mm; Mount: Surface Mount; Radiation Hardening: No; Thickness: 0.035inch; Length: 1.6mm; Max Operating Temperature: 85°C; REACH SVHC: No SVHC; Min Operating Temperature: -55°C; Construction: Flat; RoHS Compliant: Yes; Voltage Rating: 50V; Dielectric: X5R; Packaging: Tape and Reel; Termination: SMD/SMT; Voltage Rating (DC): 50V; Case Code (Imperial): 0603; Voltage: 50V; Width: 0.031inch; Weight: 7.1E-05oz; Depth: 0.8mm; Case Code (Metric): 1608; Series: C; Case/Package: 0603; Tolerance: 10%; Resistor Type: Ceramic; Number of Pins: 2; Dielectric Material: Ceramic; Package Quantity: 1
C23 C24 = CMP-2006-04440-1: Manufacturer: AVX Interconnect / Elco; Part Number: 06035C472KAZ2A
C28 = CMP-06035-052658-1: Chip Multilayer Ceramic Capacitors for General Purpose, 0805, 100uF, X5R, 15%, 20%, 6.3V; Voltage Rating (DC): 6.3V; Lead Free: Lead Free; Length: 2mm; Tolerance: 20%; Width: 1.25mm; Capacitance: 100uF; Dielectric: X5R; Thickness: 1.25mm
C29 = CMP-2000-04979-3: Multilayer Ceramic Capacitors 10μF ±10% 10V X5R SMD 0603; Capacitance: 10uF; Dielectric Material: Ceramic; Construction: Flat; Height: 0.8mm; Thickness: 0.035inch; Case Code (Metric): 1608; Radiation Hardening: No; Number of Pins: 2; Voltage Rating (DC): 10V; Depth: 0.8mm; Voltage: 10V; RoHS Compliant: Yes; Voltage Rating: 10V; Package Quantity: 1; Resistor Type: Ceramic; Termination: SMD/SMT; Lead Free: Lead Free; REACH SVHC: No SVHC; Tolerance: 10%; Mount: Surface Mount; Series: C; Packaging: Tape and Reel; Width: 0.8mm; Dielectric: X5R; Weight: 7.1E-05oz; Length: 1.6mm; Max Operating Temperature: 85°C; Case Code (Imperial): 0603; Case/Package: 0603; Min Operating Temperature: -55°C
R25 R56 R57 R?#4 R?#5 = CMP-26527-006412-1: as R4 on sheet Boost 12V; Width: 0.031inch; RoHS Compliant: Yes; Number of Terminations: 2; Case/Package: 0603; Contact Plating: Tin; Height: 0.022inch; Resistor Type: Thick Film; Mount: Surface Mount; Length: 0.061inch; Features: Automotive AEC-Q200; Series: RMCF; Max Operating Temperature: 155°C; Radiation Hardening: No; Min Operating Temperature: -55°C; Packaging: Tape and Reel
R26-R28 R30 = CMP-03211-009884-1: CRGCQ 0603 10K 5%; Manufacturer: TE Connectivity; Tolerance: 0.05; Power Rating: 0.1W; Resistance: 10KΩ; Voltage Rating: 75V; Value: 10KΩ; Temperature Coefficient: ±100ppm/°C; Composition: Thick Film; ComponentLink2URL: https://www.te.com/commerce/DocumentDelivery/DDEController?Action=showdoc&DocId=Data+Sheet%7F1773204-3%7F1%7Fpdf%7FEnglish%7FENG_DS_1773204-3_1.pdf%7F4-2176339-923; Device Class L1: Passive Components; Package: CRGCQ0603; Mouser Description: Res Thick Film 0603 10K Ohm 5% 0.1W(1/10W) ±100ppm/C Pad SMD Automotive T/R; Temperature Range High: +155°C; Category: Res; Device Class L2: Resistors; Height: 0.55mm; RoHS: TRUE; Lead Free: Yes; Ipc Land Pattern Name: RESC16080X45; Temperature: -55°C to +155°C; Series: CRGCQ; Digikey Description: CRGCQ 0603 10K 5%; Octopart: https://octopart.com/crgcq0603j10k-te+connectivity-91018097; Device Class L3: Chip SMD Resistors; Ambient Temperature Range High: +70°C; ComponentLink2Description: Datasheet; Temperature Range Low: -55°C; Manufacturer Part Number: CRGCQ0603J10K
R29 R31-R33 = CMP-2001-04239-1: Manufacturer: Vishay Dale; Part Number: CRCW08055K00FKTA
U6 = ADS1299-4PAG: Low-Noise, 4-Channel, 24-Bit Analog-to-Digital Converter for Biopotential Measurements; Manufacturer_Name: Texas Instruments; Geometry.Height: 1.2mm; Mouser Part Number: 595-ADS1299-4PAG; Mouser Price/Stock: https://www.mouser.co.uk/ProductDetail/Texas-Instruments/ADS1299-4PAG?qs=9lcNTSmDlCovTG3JfbaYgg%3D%3D; Manufacturer_Part_Number: ADS1299-4PAG; Datasheet Link: http://www.ti.com/lit/gpn/ads1299-4

## Nets that join several sheets
3V3: System (J2.9 R12.2), MCU (6 pins), DDS (Y1.4), LDO (C20.2 U5.1 U5.2), Switch1 (C11.2 U3.1), AFE (C26.1 U6.48 U6.50 U6.52)
3V3DDS: System (R12.1), DDS (11 pins), Switch1 (U3.6)
5V0: System (J2.8 R15.2), Boost 5V (5 pins), AFE (8 pins)
12V0: System (J2.7 R9.2), Boost 12V (5 pins)
GND: System (37 pins), MCU (5 pins), DDS (16 pins), PA stage 1 (8 pins), PA stage 2 (20 pins), LDO (C19.2 C20.1 U5.3 U5.7), Output (L15.2 L15.5), Boost 12V (11 pins), Switch1 (C11.1 C12.1 U3.2), Switch2 (C47.1 C48.1 U10.2), Boost 5V (12 pins), AFE (22 pins)
PA1_VDD: System (J1.8 R15.1), PA stage 1 (C35.1 R34.2 U8.1)
VBAT: System (13 pins), LDO (C19.1 U5.5 U5.6), Boost 12V (C7.2 L1.1 R4.1 U2.3), Boost 5V (C52.2 L18.1 R48.1 U11.3)
AFE_RST: System (J8.5), AFE (U6.36)
CS: System (J8.9), MCU (U1.11), AFE (U6.39)
D7: System (J1.4), MCU (U1.20), DDS (U4.25)
DDS_OUT: System (R16.2), DDS (R17.1 R19.1 R21.2 U4.21)
DDS_RST: System (J1.3), MCU (U1.19), DDS (U4.22)
DDS_WCLK: System (J1.1), MCU (U1.18), DDS (U4.7)
DRDY: System (J8.6), MCU (U1.1), AFE (U6.47)
FQ_UD: System (J1.2), MCU (U1.17), DDS (U4.8)
MCU_RST: System (J2.4), MCU (R2.1 U1.5)
MISO: System (J8.7), MCU (U1.13), AFE (U6.43)
MOSI: System (J8.10), MCU (U1.12), AFE (U6.34)
NetC47_2: System (R9.1 R10.1 R11.2), Switch2 (C47.2 U10.1)
NetJ3_1: System (J3.1), Output (L14.1 L15.3 L16.2)
NetJ4_1: System (J4.1 R54.1), PA stage 1 (R35.1), PA stage 2 (R43.2)
NetJ5_1: System (J5.1), PA stage 2 (R44.1 R46.2), Output (L15.4)
NetJ6_1: System (J6.1), Output (L15.1 L16.1 L17.2)
NetP1_1: System (P1.1), AFE (R33.1)
NetP1_2: System (P1.2), AFE (R32.1)
NetP2_1: System (P2.1), AFE (R31.1)
NetP2_2: System (P2.2), AFE (R29.1)
NetP3_1: System (P3.1), AFE (R56.2)
NetQ1_1: PA stage 1 (R39.2 R40.2), PA stage 2 (Q1.1)
NetR1_2: MCU (R1.2 U1.4), DDS (Y1.1), Switch1 (U3.3)
NetR13_1: System (R13.1), DDS (U4.14)
NetR?#2_1: MCU (U1.3), Boost 12V (R?#2.1), Switch2 (U10.3)
PA2_VDD: System (J1.9 R11.1), PA stage 2 (R41.2 R42.2), Switch2 (U10.6)
PWDN: System (J8.4), MCU (U1.8), AFE (U6.35)
QOUT: System (J7.1 R13.2 R16.1 R54.2), PA stage 1 (R36.2 R38.2)
QOUTB: System (J1.7), DDS (U4.13)
SCK: System (J8.8), MCU (U1.14), AFE (U6.40)
START: System (J8.3), MCU (U1.10), AFE (U6.38)
SWCLK: System (J2.5), MCU (U1.16)
SWDIO: System (J2.6), MCU (U1.15)
TXD: System (J2.3), MCU (U1.2)
VINN: System (J1.6), DDS (C18.1 R19.2 R20.2 U4.15)
VINP: System (J1.5), DDS (R5.1 R21.1 U4.16)